# Altium schematic sheet ADS1298.SchDoc
size A4
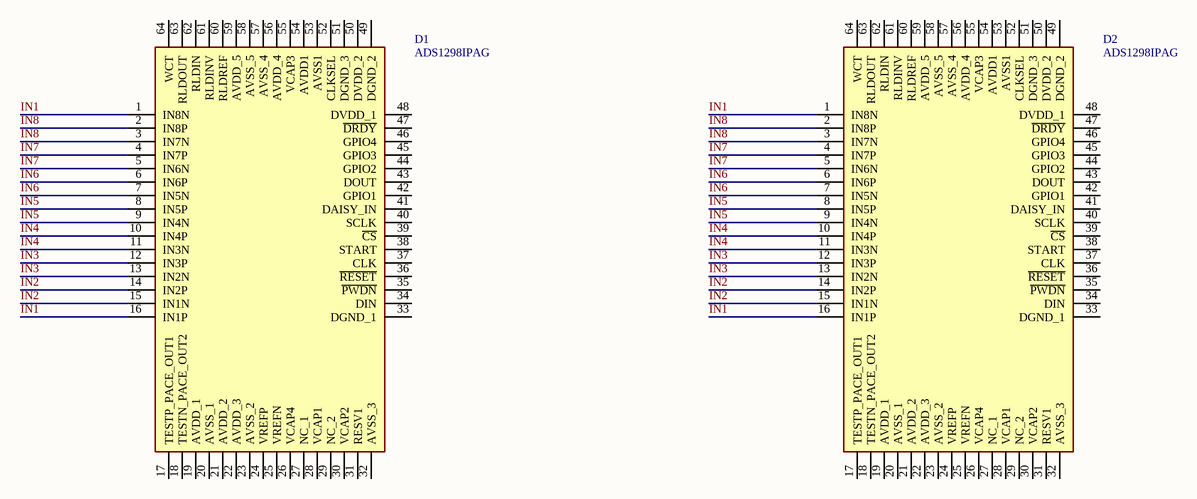
[diagram p0: ADS1298.SchDoc]

## Parts
D1  ADS1298IPAG  [QFP50P1200X1200X120-64N]
D2  ADS1298IPAG  [QFP50P1200X1200X120-64N]

## Nets
IN1: D1.1(IN8N) D1.16(IN1P) D2.1(IN8N) D2.16(IN1P)
IN2: D1.14(IN2P) D1.15(IN1N) D2.14(IN2P) D2.15(IN1N)
IN3: D1.12(IN3P) D1.13(IN2N) D2.12(IN3P) D2.13(IN2N)
IN4: D1.10(IN4P) D1.11(IN3N) D2.10(IN4P) D2.11(IN3N)
IN5: D1.8(IN5P) D1.9(IN4N) D2.8(IN5P) D2.9(IN4N)
IN6: D1.6(IN6P) D1.7(IN5N) D2.6(IN6P) D2.7(IN5N)
IN7: D1.4(IN7P) D1.5(IN6N) D2.4(IN7P) D2.5(IN6N)
IN8: D1.2(IN8P) D1.3(IN7N) D2.2(IN8P) D2.3(IN7N)

Not connected (* = marked no-connect by the designer): D1 17(TESTP_PACE_OUT1) 18(TESTN_PACE_OUT2) 19(AVDD_1) 20(AVSS_1) 21(AVDD_2) 22(AVDD_3) 23(AVSS_2) 24(VREFP) 25(VREFN) 26(VCAP4) 27(NC_1) 28(VCAP1) 29(NC_2) 30(VCAP2) 31(RESV1) 32(AVSS_3) 33(DGND_1) 34(DIN) 35(~{PWDN}) 36(~{RESET}) 37(CLK) 38(START) 39(~{CS}) 40(SCLK) 41(DAISY_IN) 42(GPIO1) 43(DOUT) 44(GPIO2) 45(GPIO3) 46(GPIO4) 47(~{DRDY}) 48(DVDD_1) 49(DGND_2) 50(DVDD_2) 51(DGND_3) 52(CLKSEL) 53(AVSS1) 54(AVDD1) 55(VCAP3) 56(AVDD_4) 57(AVSS_4) 58(AVSS_5) 59(AVDD_5) 60(RLDREF) 61(RLDINV) 62(RLDIN) 63(RLDOUT) 64(WCT); D2 17(TESTP_PACE_OUT1) 18(TESTN_PACE_OUT2) 19(AVDD_1) 20(AVSS_1) 21(AVDD_2) 22(AVDD_3) 23(AVSS_2) 24(VREFP) 25(VREFN) 26(VCAP4) 27(NC_1) 28(VCAP1) 29(NC_2) 30(VCAP2) 31(RESV1) 32(AVSS_3) 33(DGND_1) 34(DIN) 35(~{PWDN}) 36(~{RESET}) 37(CLK) 38(START) 39(~{CS}) 40(SCLK) 41(DAISY_IN) 42(GPIO1) 43(DOUT) 44(GPIO2) 45(GPIO3) 46(GPIO4) 47(~{DRDY}) 48(DVDD_1) 49(DGND_2) 50(DVDD_2) 51(DGND_3) 52(CLKSEL) 53(AVSS1) 54(AVDD1) 55(VCAP3) 56(AVDD_4) 57(AVSS_4) 58(AVSS_5) 59(AVDD_5) 60(RLDREF) 61(RLDINV) 62(RLDIN) 63(RLDOUT) 64(WCT)

## Library data of the parts
D1 D2 = ADS1298IPAG: Integrated Circuit; Manufacturer_Name: Texas Instruments; Datasheet Link: http://www.ti.com/lit/ds/symlink/ads1298.pdf; Height: 1.2mm; Manufacturer_Part_Number: ADS1298IPAG; Mouser Part Number: 595-ADS1298IPAG; Mouser Price/Stock: https://www.mouser.co.uk/ProductDetail/Texas-Instruments/ADS1298IPAG?qs=Z6FgPJT5dDR3VNlC6H4EKg%3D%3D; Arrow Part Number: ADS1298IPAG; Arrow Price/Stock: https://www.arrow.com/en/products/ads1298ipag/texas-instruments